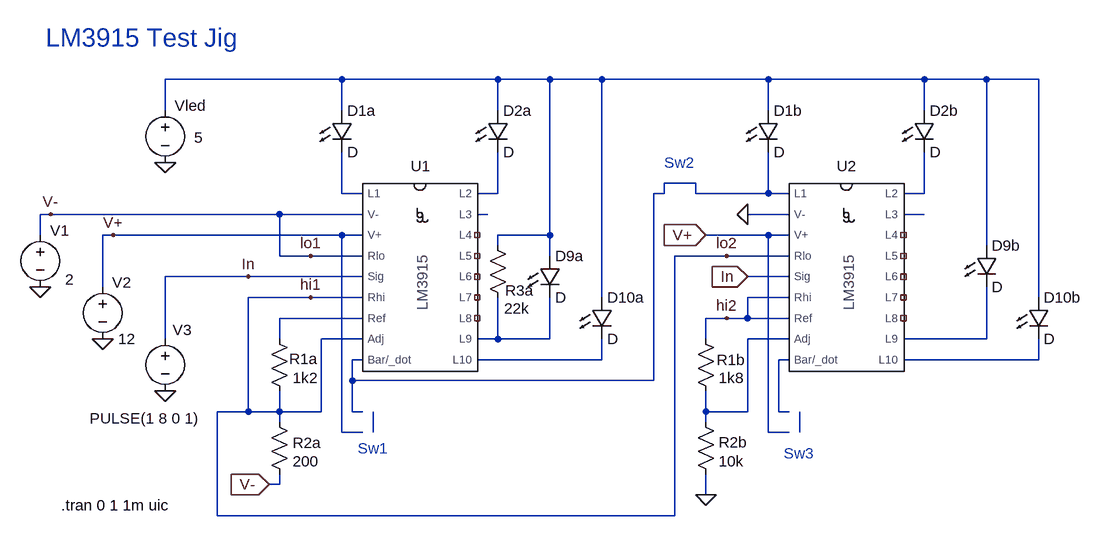
[diagram p0: schematic LM3915_Test.asc]
LM3915_Test.asc, the LTspice schematic file:
Version 4
SHEET 1 1496 692
WIRE 240 -112 -32 -112
WIRE 480 -112 240 -112
WIRE 560 -112 480 -112
WIRE 640 -112 560 -112
WIRE 896 -112 640 -112
WIRE 1136 -112 896 -112
WIRE 1232 -112 1136 -112
WIRE 1312 -112 1232 -112
WIRE -32 -64 -32 -112
WIRE 240 -64 240 -112
WIRE 480 -64 480 -112
WIRE 896 -64 896 -112
WIRE 1136 -64 1136 -112
WIRE 784 48 736 48
WIRE 240 64 240 0
WIRE 272 64 240 64
WIRE 480 64 480 0
WIRE 480 64 448 64
WIRE 736 64 736 48
WIRE 736 64 720 64
WIRE 784 64 784 48
WIRE 896 64 896 0
WIRE 896 64 784 64
WIRE 928 64 896 64
WIRE 1136 64 1136 0
WIRE 1136 64 1104 64
WIRE -208 96 -224 96
WIRE 144 96 -208 96
WIRE 272 96 144 96
WIRE 464 96 448 96
WIRE 928 96 864 96
WIRE 1136 96 1104 96
WIRE -224 128 -224 96
WIRE -112 128 -128 128
WIRE 240 128 -112 128
WIRE 272 128 240 128
WIRE 560 128 560 -112
WIRE 560 128 480 128
WIRE 896 128 800 128
WIRE 928 128 896 128
WIRE 480 144 480 128
WIRE 1232 144 1232 -112
WIRE 144 160 144 96
WIRE 192 160 144 160
WIRE 272 160 192 160
WIRE 560 160 560 128
WIRE 832 160 752 160
WIRE 928 160 832 160
WIRE 96 192 -32 192
WIRE 272 192 96 192
WIRE 928 192 864 192
WIRE -128 208 -128 128
WIRE 192 224 96 224
WIRE 272 224 192 224
WIRE 640 224 640 -112
WIRE 928 224 864 224
WIRE 1312 224 1312 -112
WIRE 272 256 144 256
WIRE 832 256 800 256
WIRE 864 256 864 224
WIRE 864 256 832 256
WIRE 928 256 864 256
WIRE -32 288 -32 192
WIRE 144 288 144 256
WIRE 272 288 208 288
WIRE 480 288 480 224
WIRE 480 288 448 288
WIRE 560 288 560 224
WIRE 560 288 480 288
WIRE 800 288 800 256
WIRE 928 288 864 288
WIRE 1232 288 1232 208
WIRE 1232 288 1104 288
WIRE 272 320 256 320
WIRE 640 320 640 288
WIRE 640 320 448 320
WIRE 928 320 912 320
WIRE 1312 320 1312 288
WIRE 1312 320 1104 320
WIRE 256 352 256 320
WIRE 720 352 720 64
WIRE 720 352 256 352
WIRE 96 400 96 224
WIRE 96 400 48 400
WIRE 144 400 144 368
WIRE 144 400 96 400
WIRE 208 400 208 288
WIRE 208 400 144 400
WIRE 256 400 256 352
WIRE 272 400 256 400
WIRE 800 400 800 368
WIRE 864 400 864 288
WIRE 864 400 800 400
WIRE 912 400 912 320
WIRE 928 400 912 400
WIRE 144 416 144 400
WIRE 800 416 800 400
WIRE 240 432 240 128
WIRE 272 432 240 432
WIRE 288 432 288 400
WIRE 896 432 896 128
WIRE 928 432 896 432
WIRE 944 432 944 400
WIRE 144 512 144 496
WIRE 144 512 128 512
WIRE 800 528 800 496
WIRE 48 560 48 400
WIRE 752 560 752 160
WIRE 752 560 48 560
FLAG -128 288 0
FLAG -32 368 0
FLAG 96 192 In
FLAG 192 224 hi1
FLAG 192 160 lo1
FLAG -224 208 0
FLAG -112 128 V+
FLAG 864 192 In
IOPIN 864 192 In
FLAG 832 256 hi2
FLAG -208 96 V-
FLAG 128 512 V-
IOPIN 128 512 In
FLAG 832 160 lo2
FLAG 864 96 0
FLAG 800 528 0
FLAG -32 16 0
FLAG 800 128 V+
IOPIN 800 128 In
SYMBOL voltage -128 192 R0
WINDOW 123 0 0 Left 2
WINDOW 39 0 0 Left 2
WINDOW 0 15 9 Left 2
SYMATTR InstName V2
SYMATTR Value 12
SYMBOL voltage -32 272 R0
WINDOW 3 -116 138 Left 2
WINDOW 123 0 0 Left 2
WINDOW 39 0 0 Left 2
WINDOW 0 12 2 Left 2
SYMATTR Value PULSE(1 8 0 1)
SYMATTR InstName V3
SYMBOL res 128 272 R0
WINDOW 0 31 47 Left 2
SYMATTR InstName R1a
SYMATTR Value 1k2
SYMBOL res 128 400 R0
WINDOW 0 36 48 Left 2
SYMATTR InstName R2a
SYMATTR Value 200
SYMBOL voltage -224 112 R0
WINDOW 123 0 0 Left 2
WINDOW 39 0 0 Left 2
WINDOW 0 15 9 Left 2
WINDOW 3 38 84 Left 2
SYMATTR InstName V1
SYMATTR Value 2
SYMBOL res 464 128 R0
WINDOW 0 27 85 Left 2
WINDOW 3 26 113 Left 2
SYMATTR InstName R3a
SYMATTR Value 22k
SYMBOL res 784 272 R0
WINDOW 0 33 48 Left 2
SYMATTR InstName R1b
SYMATTR Value 1k8
SYMBOL res 784 400 R0
WINDOW 0 36 47 Left 2
SYMATTR InstName R2b
SYMATTR Value 10k
SYMBOL voltage -32 -80 R0
WINDOW 123 0 0 Left 2
WINDOW 39 0 0 Left 2
WINDOW 0 15 9 Left 2
WINDOW 3 45 58 Left 2
SYMATTR InstName Vled
SYMATTR Value 5
SYMBOL LED 224 -64 R0
SYMATTR InstName D1a
SYMBOL LED 464 -64 R0
SYMATTR InstName D2a
SYMBOL LED 544 160 R0
SYMATTR InstName D9a
SYMBOL LED 624 224 R0
SYMATTR InstName D10a
SYMBOL LED 880 -64 R0
SYMATTR InstName D1b
SYMBOL LED 1120 -64 R0
SYMATTR InstName D2b
SYMBOL LED 1216 144 R0
SYMATTR InstName D9b
SYMBOL LED 1296 224 R0
SYMATTR InstName D10b
SYMBOL LM3915 368 256 R0
SYMATTR InstName U1
SYMBOL LM3915 1024 256 R0
SYMATTR InstName U2
TEXT -192 544 Left 2 !.tran 0 1 1m uic
TEXT -216 -176 Left 4 ;LM3915 Test Jig
TEXT 264 456 Left 2 ;Sw1
TEXT 736 16 Left 2 ;Sw2
TEXT 920 464 Left 2 ;Sw3

The netlist it stands for:
* LM3915_Test.asc
V2 V+ 0 12
V3 In 0 PULSE(1 8 0 1)
R1a N008 lo2 1k2
R2a lo2 V- 200
V1 V- 0 2
R3a N001 N009 22k
R1b hi2 N010 1k8
R2b N010 0 10k
Vled N001 0 5
D1a N001 N003 D
D2a N001 N004 D
D9a N001 N009 D
D10a N001 N012 D
D1b N001 N002 D
D2b N001 N005 D
D9b N001 N011 D
D10b N001 N014 D
XU1 N002 lo2 In V+ V- lo2 N003 N012 N004 N006 NC_01 NC_02 NC_03 NC_04 NC_05 N009 N008 V- LM3915  ; pins Bar/_dot Rhi Sig V+ V- Adj L1 L10 L2 L3 L4 L5 L6 L7 L8 L9 Ref Rlo
XU2 N013 hi2 In V+ 0 N010 N002 N014 N005 N007 NC_06 NC_07 NC_08 NC_09 NC_10 N011 hi2 lo2 LM3915  ; pins Bar/_dot Rhi Sig V+ V- Adj L1 L10 L2 L3 L4 L5 L6 L7 L8 L9 Ref Rlo
.model D D
.lib standard.dio
.tran 0 1 1m uic
* LM3915 Test Jig
* Sw1
* Sw2
* Sw3
.lib LM3915.sub
.backanno
.end